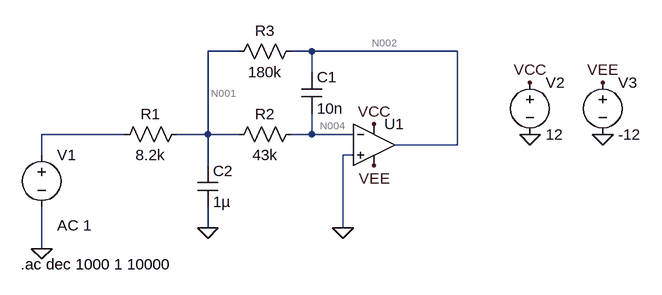
[diagram p0: schematic Pasa bajos MFB 2do orden.asc]
Pasa bajos MFB 2do orden.asc, the LTspice schematic file:
Version 4
SHEET 1 880 680
WIRE -512 48 -560 48
WIRE -400 48 -432 48
WIRE -176 48 -400 48
WIRE -400 80 -400 48
WIRE -688 176 -816 176
WIRE -560 176 -560 48
WIRE -560 176 -608 176
WIRE -512 176 -560 176
WIRE -400 176 -400 144
WIRE -400 176 -432 176
WIRE -336 176 -400 176
WIRE -176 192 -176 48
WIRE -176 192 -272 192
WIRE -816 208 -816 176
WIRE -336 208 -352 208
WIRE -560 224 -560 176
WIRE -560 320 -560 288
WIRE -352 320 -352 208
WIRE -816 352 -816 288
FLAG -560 320 0
FLAG -816 352 0
FLAG -304 224 VEE
FLAG -304 160 VCC
FLAG -64 176 0
FLAG 48 176 0
FLAG 48 96 VEE
FLAG -64 96 VCC
FLAG -352 320 0
SYMBOL OpAmps\\UniversalOpAmp -304 192 R0
SYMATTR InstName U1
SYMBOL res -592 160 R90
WINDOW 0 0 56 VBottom 2
WINDOW 3 32 56 VTop 2
SYMATTR InstName R1
SYMATTR Value 8.2k
SYMBOL res -416 160 R90
WINDOW 0 0 56 VBottom 2
WINDOW 3 32 56 VTop 2
SYMATTR InstName R2
SYMATTR Value 43k
SYMBOL res -416 32 R90
WINDOW 0 0 56 VBottom 2
WINDOW 3 32 56 VTop 2
SYMATTR InstName R3
SYMATTR Value 180k
SYMBOL cap -416 80 R0
SYMATTR InstName C1
SYMATTR Value 10n
SYMBOL cap -576 224 R0
SYMATTR InstName C2
SYMATTR Value 1µ
SYMBOL voltage -816 192 R0
WINDOW 123 24 124 Left 2
WINDOW 39 0 0 Left 0
SYMATTR Value2 AC 1
SYMATTR InstName V1
SYMATTR Value ""
SYMBOL voltage -64 80 R0
WINDOW 123 0 0 Left 0
WINDOW 39 0 0 Left 0
SYMATTR InstName V2
SYMATTR Value 12
SYMBOL voltage 48 80 R0
WINDOW 123 0 0 Left 0
WINDOW 39 0 0 Left 0
SYMATTR InstName V3
SYMATTR Value -12
TEXT -848 376 Left 2 !.ac dec 1000 1 10000

The netlist it stands for:
* Pasa bajos MFB 2do orden.asc
XU1 0 N004 VCC VEE N002 level1 Avol=1Meg GBW=10Meg Vos=0 En=0 Enk=0 In=0 Ink=0 Rin=500Meg  ; pins In+ In- V+ V- OUT
R1 N001 N003 8.2k
R2 N004 N001 43k
R3 N002 N001 180k
C1 N002 N004 10n
C2 N001 0 1µ
V1 N003 0 AC 1
V2 VCC 0 12
V3 VEE 0 -12
.ac dec 1000 1 10000
.lib UniversalOpAmp1.lib
.backanno
.end

* Results of the author's LTspice run, read from the files saved beside the schematic
* Operating Point, zero values left out:
*   V(vcc) = 12 V
*   V(vee) = -12 V
*   I(V3) = 24 nA
*   I(V2) = -24 nA
*   Ix(u1:3) = 24 nA
*   Ix(u1:4) = -24 nA
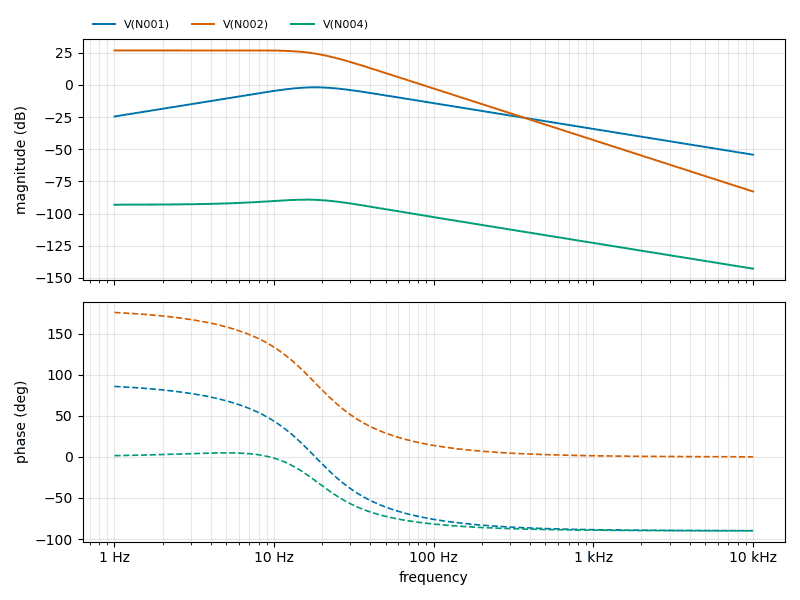
[diagram p1: AC Analysis of Pasa bajos MFB 2do orden.asc, plotted from the saved traces]
* AC Analysis, 1 run:
*   V(N001): -24.53 dB at 1 Hz, -54.24 dB at 10 kHz, peak -1.84 dB at 18.07 Hz, 3 dB below the peak at 9.71 Hz and 33.7 Hz
*   V(N002): 26.83 dB at 1 Hz, -82.87 dB at 10 kHz, peak 26.89 dB at 6.281 Hz, 3 dB below the peak at 19.09 Hz
*   V(N004): -93.12 dB at 1 Hz, -142.87 dB at 10 kHz, peak -89.19 dB at 15.92 Hz, 3 dB below the peak at 4.85 Hz and 30.2 Hz